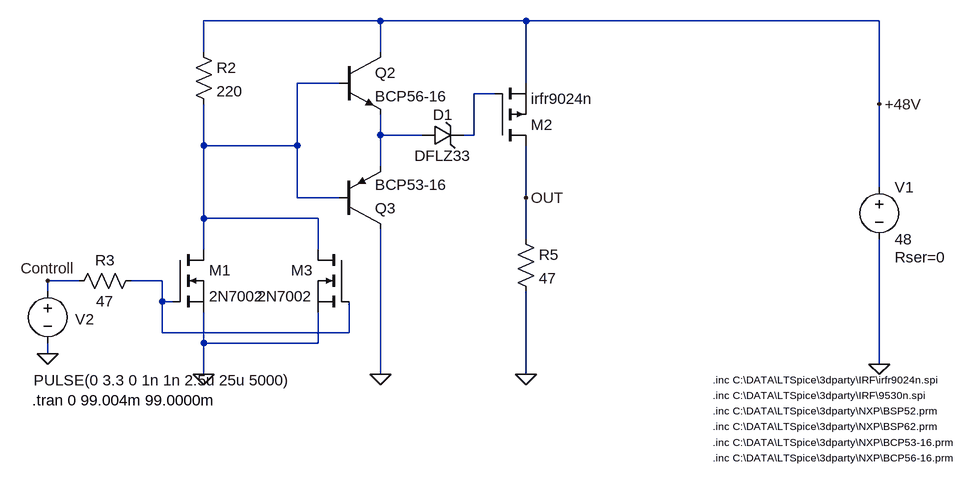
[diagram p0: schematic test003.asc]
test003.asc, the LTspice schematic file:
Version 4
SHEET 1 908 680
WIRE -112 -128 -384 -128
WIRE 112 -128 -112 -128
WIRE 656 -128 112 -128
WIRE -384 -80 -384 -128
WIRE -112 -80 -112 -128
WIRE -176 -32 -240 -32
WIRE 112 -32 112 -128
WIRE 64 -16 32 -16
WIRE 656 0 656 -128
WIRE -112 48 -112 16
WIRE -48 48 -112 48
WIRE 32 48 32 -16
WIRE 32 48 16 48
WIRE -384 64 -384 0
WIRE -240 64 -240 -32
WIRE -240 64 -384 64
WIRE -112 96 -112 48
WIRE 656 128 656 0
WIRE -240 144 -240 64
WIRE -176 144 -240 144
WIRE 112 144 112 64
WIRE -384 176 -384 64
WIRE -208 176 -384 176
WIRE 112 208 112 144
WIRE -384 224 -384 176
WIRE -208 224 -208 176
WIRE -576 272 -624 272
WIRE -448 272 -496 272
WIRE -624 288 -624 272
WIRE -448 304 -448 272
WIRE -432 304 -448 304
WIRE -448 352 -448 304
WIRE -160 352 -160 304
WIRE -160 352 -448 352
WIRE -384 368 -384 320
WIRE -208 368 -208 320
WIRE -208 368 -384 368
WIRE -624 384 -624 368
WIRE 656 400 656 208
WIRE -384 416 -384 368
WIRE -112 416 -112 192
WIRE 112 416 112 288
FLAG 656 400 0
FLAG -624 384 0
FLAG 656 0 +48V
FLAG -624 272 Controll
FLAG -384 416 0
FLAG 112 416 0
FLAG -112 416 0
FLAG 112 144 OUT
SYMBOL voltage 656 112 R0
WINDOW 123 0 0 Left 2
WINDOW 39 24 124 Left 2
SYMATTR SpiceLine Rser=0
SYMATTR InstName V1
SYMATTR Value 48
SYMBOL voltage -624 272 R0
WINDOW 0 42 59 Left 2
WINDOW 3 -22 153 Left 2
WINDOW 123 0 0 Left 2
WINDOW 39 0 0 Left 2
SYMATTR InstName V2
SYMATTR Value PULSE(0 3.3 0 1n 1n 2.5u 25u 5000)
SYMBOL res -400 -96 R0
SYMATTR InstName R2
SYMATTR Value 220
SYMBOL res -480 256 R90
WINDOW 0 0 56 VBottom 2
WINDOW 3 32 56 VTop 2
SYMATTR InstName R3
SYMATTR Value 47
SYMBOL npn -176 -80 R0
SYMATTR InstName Q2
SYMATTR Value BCP56-16
SYMATTR Prefix X
SYMBOL pnp -176 192 M180
SYMATTR InstName Q3
SYMATTR Value BCP53-16
SYMATTR Prefix X
SYMBOL res 96 192 R0
SYMATTR InstName R5
SYMATTR Value 47
SYMBOL nmos -432 224 R0
SYMATTR InstName M1
SYMATTR Value 2N7002
SYMBOL pmos 64 64 M180
SYMATTR InstName M2
SYMATTR Value irfr9024n
SYMATTR Prefix X
SYMBOL zener -48 64 R270
WINDOW 0 32 32 VTop 2
WINDOW 3 0 32 VBottom 2
SYMATTR InstName D1
SYMATTR Value DFLZ33
SYMATTR Description Diode
SYMATTR Type diode
SYMBOL nmos -160 224 M0
SYMATTR InstName M3
SYMATTR Value 2N7002
TEXT -648 456 Left 2 !.tran 0 99.004m 99.0000m
TEXT 400 448 Left 1 !.inc C:\\DATA\\LTSpice\\3dparty\\IRF\\9530n.spi
TEXT 400 472 Left 1 !.inc C:\\DATA\\LTSpice\\3dparty\\NXP\\BSP52.prm
TEXT 400 496 Left 1 !.inc C:\\DATA\\LTSpice\\3dparty\\NXP\\BSP62.prm
TEXT 400 424 Left 1 !.inc C:\\DATA\\LTSpice\\3dparty\\IRF\\irfr9024n.spi
TEXT 400 520 Left 1 !.inc C:\\DATA\\LTSpice\\3dparty\\NXP\\BCP53-16.prm
TEXT 400 544 Left 1 !.inc C:\\DATA\\LTSpice\\3dparty\\NXP\\BCP56-16.prm

The netlist it stands for:
* test003.asc
V1 +48V 0 48 Rser=0
V2 Controll 0 PULSE(0 3.3 0 1n 1n 2.5u 25u 5000)
R2 +48V N001 220
R3 N004 Controll 47
XQ2 +48V N001 N003 BCP56-16  ; pins C B E
XQ3 0 N001 N003 BCP53-16  ; pins C B E
R5 OUT 0 47
M1 N001 N004 0 0 2N7002
XM2 OUT N002 +48V irfr9024n  ; pins D G S
D1 N003 N002 DFLZ33
M3 N001 N004 0 0 2N7002
.model D D
.lib standard.dio
.model NMOS NMOS
.model PMOS PMOS
.lib standard.mos
.tran 0 99.004m 99.0000m
.inc C:\DATA\LTSpice\3dparty\IRF\9530n.spi
.inc C:\DATA\LTSpice\3dparty\NXP\BSP52.prm
.inc C:\DATA\LTSpice\3dparty\NXP\BSP62.prm
.inc C:\DATA\LTSpice\3dparty\IRF\irfr9024n.spi
.inc C:\DATA\LTSpice\3dparty\NXP\BCP53-16.prm
.inc C:\DATA\LTSpice\3dparty\NXP\BCP56-16.prm
.backanno
.end